# EAGLE design M117 (EAGLE 6.6.0)
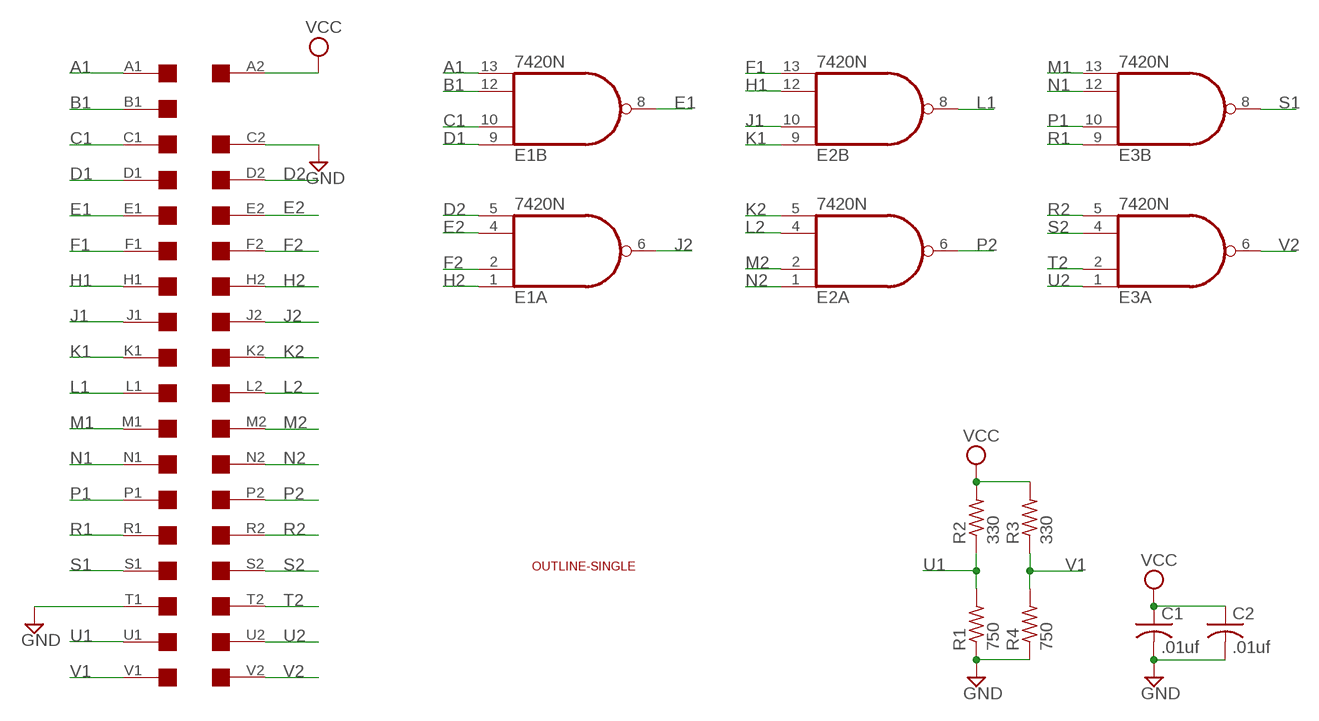
[diagram p0: schematic, sheet 1]

## Parts
C1  .01uf  C-US050-025X075  [C050-025X075]
C2  .01uf  C-US050-025X075  [C050-025X075]
E1  7420N  74S20N  [DIL14]
E2  7420N  74S20N  [DIL14]
E3  7420N  74S20N  [DIL14]
R1  750  R-US_0207/10  [0207/10]
R2  330  R-US_0207/10  [0207/10]
R3  330  R-US_0207/10  [0207/10]
R4  750  R-US_0207/10  [0207/10]
U$1  SINGLE  [EDGE-CON2]
U$4  OUTLINE-SINGLE  [SINGLE]

## Nets
A1: E1.13(B:I3) U$1.A1
B1: E1.12(B:I2) U$1.B1
C1: E1.10(B:I1) U$1.C1
D1: E1.9(B:I0) U$1.D1
D2: E1.5(A:I3) U$1.D2
E1: E1.8(B:O) U$1.E1
E2: E1.4(A:I2) U$1.E2
F1: E2.13(B:I3) U$1.F1
F2: E1.2(A:I1) U$1.F2
GND: C1.2 C2.2 R1.1 R4.1 U$1.C2 U$1.T1
H1: E2.12(B:I2) U$1.H1
H2: E1.1(A:I0) U$1.H2
J1: E2.10(B:I1) U$1.J1
J2: E1.6(A:O) U$1.J2
K1: E2.9(B:I0) U$1.K1
K2: E2.5(A:I3) U$1.K2
L1: E2.8(B:O) U$1.L1
L2: E2.4(A:I2) U$1.L2
M1: E3.13(B:I3) U$1.M1
M2: E2.2(A:I1) U$1.M2
N1: E3.12(B:I2) U$1.N1
N2: E2.1(A:I0) U$1.N2
P1: E3.10(B:I1) U$1.P1
P2: E2.6(A:O) U$1.P2
R1: E3.9(B:I0) U$1.R1
R2: E3.5(A:I3) U$1.R2
S1: E3.8(B:O) U$1.S1
S2: E3.4(A:I2) U$1.S2
T2: E3.2(A:I1) U$1.T2
U1: R1.2 R2.1 U$1.U1
U2: E3.1(A:I0) U$1.U2
V1: R3.1 R4.2 U$1.V1
V2: E3.6(A:O) U$1.V2
VCC: C1.1 C2.1 R2.2 R3.2 U$1.A2
Unconnected: U$1.B2

## Power pins joined to a net without a drawn wire
GND: E1.7(P:GND) E2.7(P:GND) E3.7(P:GND)
VCC: E1.14(P:VCC) E2.14(P:VCC) E3.14(P:VCC)

## Library data of the parts
C1 C2 = rcl:C-US: CAPACITOR, American symbol
E1-E3 = 74xx-us:74*20: Dual 4-input NAND gate
R1-R4 = rcl:R-US_: RESISTOR, American symbol
U$1 = dec-con:SINGLE: Single-Height DEC board
U$4 = dec-con:OUTLINE-*: Board outlines for DEC boards.

## Board
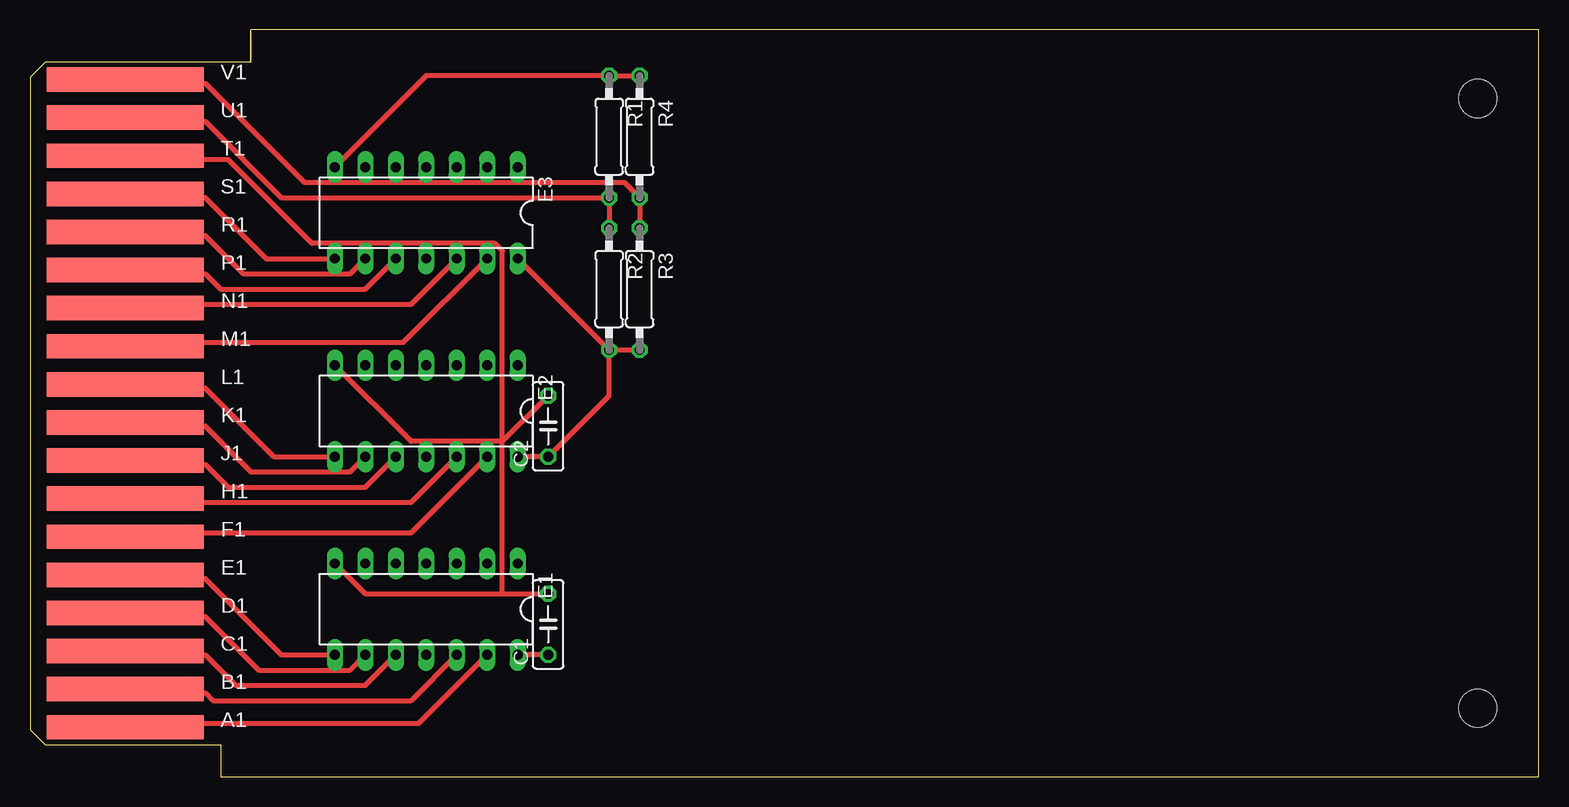
[diagram p1: board, top side]
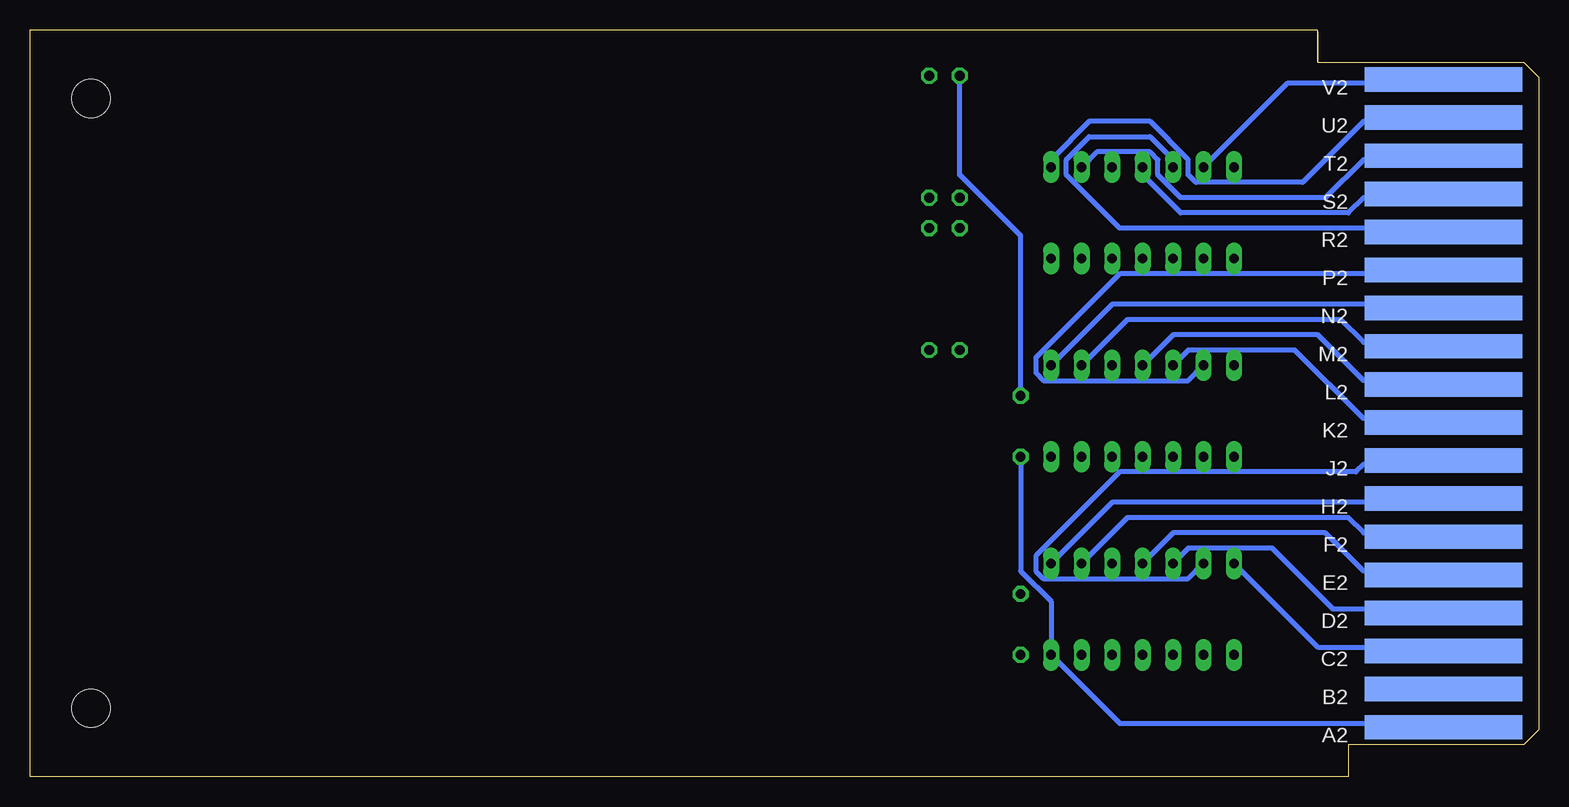
[diagram p2: board, bottom side, seen from below]

Size 125.73 x 62.23 mm. Coordinates in mm from the lower left corner, seen from the top.
Copper layers (1+16): Top 0.035mm / dielectric 1.5mm / Bottom 0.035mm
Design rules "16mils": minimum track width 16mil, minimum drill 32mil, track to track 15mil, track to pad 10mil, pad to pad 10mil, via to via 10mil, smd to smd 10mil, copper to edge 13mil, drill to drill 10mil, minimum pad ring 10mil, minimum via ring 8mil, stop-mask expansion 0mil, vias tented up to drill 0mil, thermal gap 10mil

### Footprints (pad centres in the part's own frame; a part is rotated, then mirrored left to right if it is on the bottom)
C050-025X075 = drill 0.813 octagon: 1 -2.54,0; 2 2.54,0
DIL14 = drill 0.813 long: 1 -7.62,-3.81; 2 -5.08,-3.81; 3 -2.54,-3.81; 4 0,-3.81; 5 2.54,-3.81; 6 5.08,-3.81; 7 7.62,-3.81; 8 7.62,3.81; 9 5.08,3.81; 10 2.54,3.81; 11 0,3.81; 12 -2.54,3.81; 13 -5.08,3.81; 14 -7.62,3.81
0207/10 = drill 0.813 octagon: 1 -5.08,0; 2 5.08,0
EDGE-CON2 = smd 13.106 x 2.032: A1 7.938,4.128; B1 7.938,7.303; C1 7.938,10.477; D1 7.938,13.652; E1 7.938,16.828; F1 7.938,20.003; H1 7.938,23.177; J1 7.938,26.352; K1 7.938,29.527; L1 7.938,32.703; M1 7.938,35.877; N1 7.938,39.053; P1 7.938,42.227; R1 7.938,45.403; S1 7.938,48.578; T1 7.938,51.752; U1 7.938,54.928; V1 7.938,58.102 | smd 13.106 x 2.032 bottom: A2 7.938,4.128; B2 7.938,7.303; C2 7.938,10.477; D2 7.938,13.652; E2 7.938,16.828; F2 7.938,20.003; H2 7.938,23.177; J2 7.938,26.352; K2 7.938,29.527; L2 7.938,32.703; M2 7.938,35.877; N2 7.938,39.053; P2 7.938,42.227; R2 7.938,45.403; S2 7.938,48.578; T2 7.938,51.752; U2 7.938,54.928; V2 7.938,58.102
SINGLE = hole 3.175: 120.65,56.515; 120.65,5.715

### Placement (x,y rotation side)
C1  43.18,12.7 90 top
C2  43.18,29.21 90 top
E1  33.02,13.97 180 top
E2  33.02,30.48 180 top
E3  33.02,46.99 180 top
R1  48.26,53.34 270 top
R2  48.26,40.64 270 top
R3  50.8,40.64 270 top
R4  50.8,53.34 270 top
U$1  0,0 0 top
U$4  0,0 0 top

### Tracks (layer width: path | path; a pad name or v marks a point on that pad's centre or on a via)
A1
  Top 0.406: E1.13 32.39,4.45 8.26,4.45 U$1.A1
B1
  Top 0.406: E1.12 31.75,6.35 15.24,6.35 14.61,6.99 8.26,6.99 U$1.B1
C1
  Top 0.406: E1.10 27.94,7.62 17.15,7.62 14.61,10.16 8.26,10.16 U$1.C1
D1
  Top 0.406: E1.9 26.67,8.89 19.05,8.89 14.61,13.34 8.26,13.34 U$1.D1
D2
  Bottom 0.406: E1.5 29.21,19.05 22.23,19.05 17.15,13.97 8.26,13.97 U$1.D2
E1
  Top 0.406: E1.8 20.96,10.16 14.61,16.51 8.26,16.51 U$1.E1
E2
  Bottom 0.406: E1.4 30.48,20.32 17.78,20.32 14.61,17.14 8.26,17.14 U$1.E2
F1
  Top 0.406: E2.13 31.75,20.32 8.26,20.32 U$1.F1
F2
  Bottom 0.406: E1.2 34.29,21.59 15.88,21.59 14.61,20.32 8.26,20.32 U$1.F2
GND
  Top 0.406: E3.7 33.02,58.42 R1.1 R4.1 | 39.37,15.24 27.94,15.24 E1.7 | 39.37,15.24 C1.2 | 39.37,27.94 C2.2 | 39.37,15.24 39.37,27.94 | E2.7 31.75,27.94 39.37,27.94 | 39.37,27.94 39.37,43.81 38.74,44.45 23.5,44.45 16.51,51.44 8.26,51.44 U$1.T1
  Bottom 0.406: E1.7 18.42,10.79 8.26,10.79 U$1.C2 | R1.1 48.26,50.16 43.18,45.09 C2.2
H1
  Top 0.406: E2.12 31.75,22.86 8.26,22.86 U$1.H1
H2
  Bottom 0.406: E1.1 35.56,22.86 8.26,22.86 U$1.H2
J1
  Top 0.406: E2.10 27.94,24.13 16.51,24.13 14.61,26.04 8.26,26.04 U$1.J1
J2
  Bottom 0.406: E1.6 29.21,16.51 41.28,16.51 41.91,17.14 41.91,18.41 34.93,25.4 15.24,25.4 14.61,26.04 8.26,26.04 U$1.J2
K1
  Top 0.406: E2.9 26.67,25.4 18.42,25.4 14.61,29.21 8.26,29.21 U$1.K1
K2
  Bottom 0.406: E2.5 29.21,35.56 20.32,35.56 14.61,29.84 8.26,29.84 U$1.K2
L1
  Top 0.406: E2.8 20.32,26.67 14.61,32.38 8.26,32.38 U$1.L1
L2
  Bottom 0.406: E2.4 30.48,36.83 18.42,36.83 14.61,33.02 8.26,33.02 U$1.L2
M1
  Top 0.406: E3.13 31.12,36.2 8.26,36.2 U$1.M1
M2
  Bottom 0.406: E2.2 34.29,38.1 16.51,38.1 14.61,36.2 8.26,36.2 U$1.M2
N1
  Top 0.406: E3.12 31.75,39.37 8.26,39.37 U$1.N1
N2
  Bottom 0.406: E2.1 35.56,39.37 8.26,39.37 U$1.N2
P1
  Top 0.406: E3.10 27.94,40.64 15.88,40.64 14.61,41.91 8.26,41.91 U$1.P1
P2
  Bottom 0.406: E2.6 29.21,33.02 41.28,33.02 41.91,33.66 41.91,34.92 34.93,41.91 8.26,41.91 U$1.P2
R1
  Top 0.406: E3.9 26.67,41.91 17.78,41.91 14.61,45.09 8.26,45.09 U$1.R1
R2
  Bottom 0.406: E3.5 30.48,51.44 32.39,53.34 37.47,53.34 39.37,51.44 39.37,50.16 34.93,45.72 8.26,45.72 U$1.R2
S1
  Top 0.406: E3.8 19.69,43.18 14.61,48.26 8.26,48.26 U$1.S1
S2
  Bottom 0.406: E3.4 33.02,50.16 29.85,46.99 15.88,46.99 14.61,48.26 8.26,48.26 U$1.S2
T2
  Bottom 0.406: E3.2 36.83,52.07 32.39,52.07 31.75,51.44 31.75,50.16 29.85,48.26 17.78,48.26 14.61,51.44 8.26,51.44 U$1.T2
U1
  Top 0.406: R2.1 R1.2 20.96,48.26 14.61,54.61 8.26,54.61 U$1.U1
U2
  Bottom 0.406: E3.1 40.64,51.44 37.47,54.61 32.39,54.61 29.21,51.44 29.21,50.16 28.58,49.53 19.69,49.53 14.61,54.61 8.26,54.61 U$1.U2
V1
  Top 0.406: R3.1 R4.2 49.53,49.53 22.86,49.53 14.61,57.78 8.26,57.78 U$1.V1
V2
  Bottom 0.406: E3.6 20.96,57.78 8.26,57.78 U$1.V2
VCC
  Top 0.406: R3.2 R2.2 | R2.2 E3.14 | C1.1 E1.14 | E2.14 C2.1 48.26,31.75 R2.2
  Bottom 0.406: C2.1 43.18,17.14 40.64,14.61 E1.14 34.93,4.45 8.26,4.45 U$1.A2